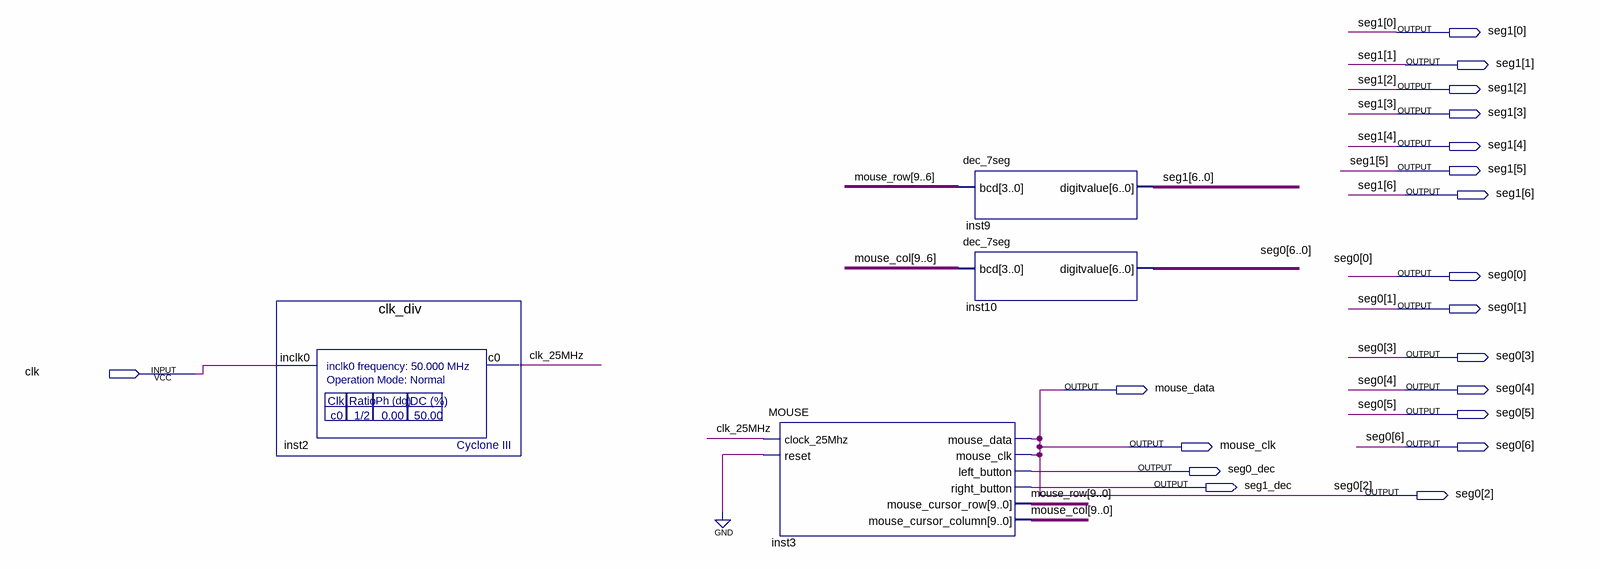
[diagram p0: schematic sheet]
// Quartus schematic mouse.bdf as structural Verilog: 4 symbols, 19 pins
module mouse (
  input  clk,
  output [6:0] seg1,
  output [6:0] seg0,
  output mouse_data,
  output mouse_clk,
  output seg0_dec,
  output seg1_dec
);

  wire clk_25MHz;
  wire [9:0] mouse_col, mouse_row;

  clk_div inst2 (.inclk0(clk), .c0(clk_25MHz));
  MOUSE inst3 (
    .clock_25Mhz(clk_25MHz), .reset(1'b0), .left_button(seg0_dec), .right_button(seg1_dec),
    .mouse_cursor_row(mouse_row), .mouse_cursor_column(mouse_col), .mouse_data(mouse_clk),
    .mouse_clk(mouse_clk));
  dec_7seg inst9 (.bcd(mouse_row[9:6]), .digitvalue(seg1));
  dec_7seg inst10 (.bcd(mouse_col[9:6]), .digitvalue({seg0[6:3], mouse_clk, seg0[1:0]}));

  assign mouse_data = mouse_clk;
  assign seg0[2] = mouse_clk;
endmodule
